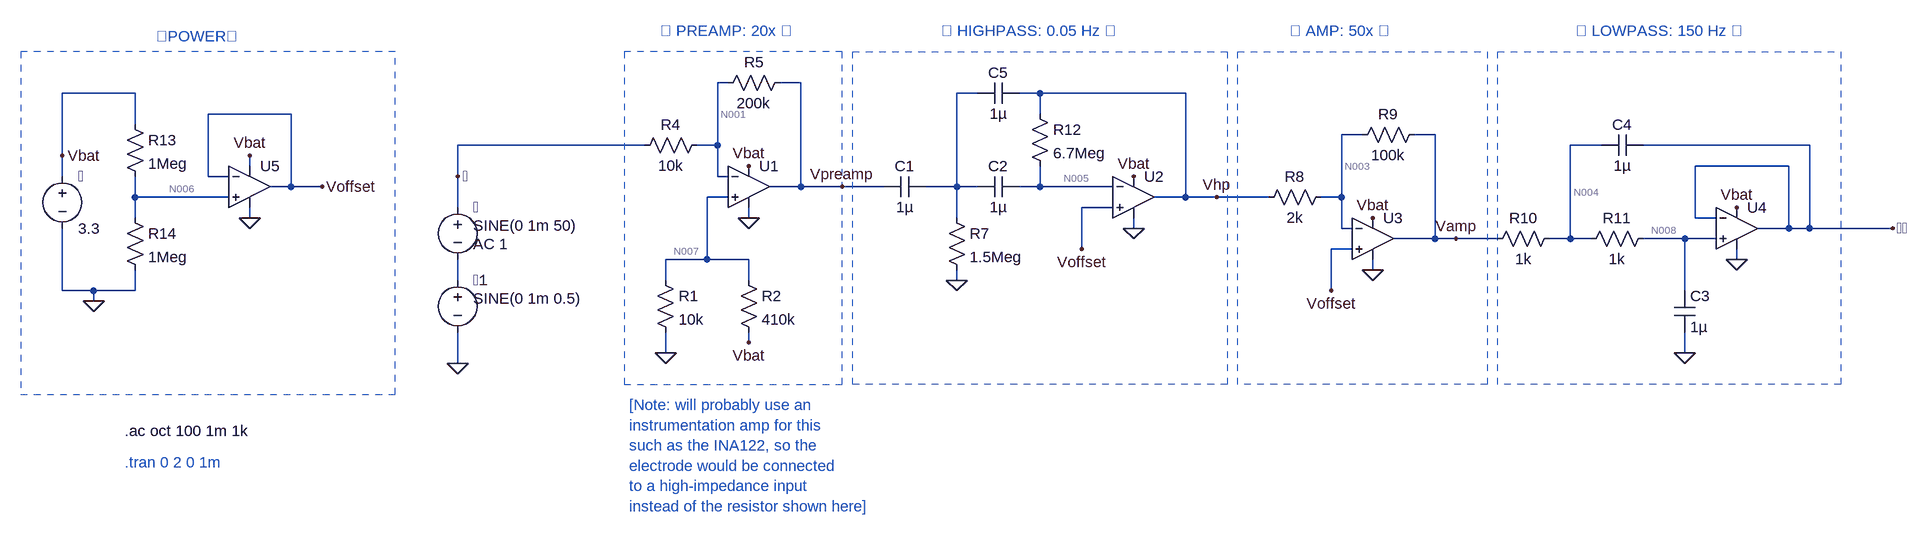
[diagram p0: schematic ecg_amp_filter.asc]
ecg_amp_filter.asc, the LTspice schematic file:
Version 4
SHEET 1 2764 680
WIRE 752 -1728 736 -1728
WIRE 864 -1728 832 -1728
WIRE -160 -1712 -272 -1712
WIRE 1136 -1712 1104 -1712
WIRE 1232 -1712 1200 -1712
WIRE 1456 -1712 1232 -1712
WIRE 80 -1680 -48 -1680
WIRE 1232 -1680 1232 -1712
WIRE -160 -1664 -160 -1712
WIRE 1728 -1648 1696 -1648
WIRE 1840 -1648 1808 -1648
WIRE 624 -1632 336 -1632
WIRE 736 -1632 736 -1728
WIRE 736 -1632 704 -1632
WIRE 2096 -1632 2048 -1632
WIRE 2416 -1632 2160 -1632
WIRE -272 -1616 -272 -1712
WIRE 16 -1600 16 -1616
WIRE 2384 -1600 2240 -1600
WIRE -272 -1584 -272 -1616
WIRE -48 -1584 -48 -1680
WIRE -16 -1584 -48 -1584
WIRE 336 -1584 336 -1632
WIRE 736 -1584 736 -1632
WIRE 752 -1584 736 -1584
WIRE 80 -1568 80 -1680
WIRE 80 -1568 48 -1568
WIRE 128 -1568 80 -1568
WIRE 864 -1568 864 -1728
WIRE 864 -1568 816 -1568
WIRE 928 -1568 864 -1568
WIRE 992 -1568 928 -1568
WIRE 1104 -1568 1104 -1712
WIRE 1104 -1568 1056 -1568
WIRE 1136 -1568 1104 -1568
WIRE 1232 -1568 1232 -1600
WIRE 1232 -1568 1200 -1568
WIRE 1344 -1568 1232 -1568
WIRE -160 -1552 -160 -1584
WIRE -16 -1552 -160 -1552
WIRE 752 -1552 720 -1552
WIRE 1456 -1552 1456 -1712
WIRE 1456 -1552 1408 -1552
WIRE 1504 -1552 1456 -1552
WIRE 1584 -1552 1504 -1552
WIRE 1696 -1552 1696 -1648
WIRE 1696 -1552 1664 -1552
WIRE 336 -1536 336 -1584
WIRE 1344 -1536 1296 -1536
WIRE -160 -1520 -160 -1552
WIRE 16 -1520 16 -1536
WIRE 784 -1520 784 -1536
WIRE 1104 -1520 1104 -1568
WIRE 2240 -1520 2240 -1600
WIRE 2272 -1520 2240 -1520
WIRE 1376 -1504 1376 -1520
WIRE 1696 -1504 1696 -1552
WIRE 1712 -1504 1696 -1504
WIRE 2384 -1504 2384 -1600
WIRE 2384 -1504 2336 -1504
WIRE 2416 -1504 2416 -1632
WIRE 2416 -1504 2384 -1504
WIRE 2544 -1504 2416 -1504
WIRE 1840 -1488 1840 -1648
WIRE 1840 -1488 1776 -1488
WIRE 1872 -1488 1840 -1488
WIRE 1936 -1488 1872 -1488
WIRE 2048 -1488 2048 -1632
WIRE 2048 -1488 2016 -1488
WIRE 2080 -1488 2048 -1488
WIRE 2224 -1488 2160 -1488
WIRE 2272 -1488 2224 -1488
WIRE 1296 -1472 1296 -1536
WIRE 1712 -1472 1680 -1472
WIRE 720 -1456 720 -1552
WIRE 720 -1456 656 -1456
WIRE 784 -1456 720 -1456
WIRE 2304 -1456 2304 -1472
WIRE 1744 -1440 1744 -1456
WIRE 336 -1424 336 -1456
WIRE 656 -1424 656 -1456
WIRE 784 -1424 784 -1456
WIRE 1104 -1424 1104 -1440
WIRE -272 -1408 -272 -1504
WIRE -224 -1408 -272 -1408
WIRE -160 -1408 -160 -1440
WIRE -160 -1408 -224 -1408
WIRE 1680 -1408 1680 -1472
WIRE 2224 -1408 2224 -1488
WIRE -224 -1392 -224 -1408
WIRE 784 -1328 784 -1344
WIRE 656 -1312 656 -1344
WIRE 2224 -1312 2224 -1344
WIRE 336 -1296 336 -1344
FLAG 336 -1296 0
FLAG -272 -1616 Vbat
FLAG 784 -1600 Vbat
FLAG 1376 -1584 Vbat
FLAG 1744 -1520 Vbat
FLAG 2224 -1312 0
FLAG 2304 -1536 Vbat
FLAG 2544 -1504 🧡💻
FLAG 336 -1584 💛
FLAG 928 -1568 Vpreamp
FLAG 1872 -1488 Vamp
FLAG -224 -1392 0
FLAG 656 -1312 0
FLAG 784 -1328 Vbat
FLAG 784 -1520 0
FLAG 1376 -1504 0
FLAG 1744 -1440 0
FLAG 2304 -1456 0
FLAG 1104 -1424 0
FLAG 128 -1568 Voffset
FLAG 1296 -1472 Voffset
FLAG 1680 -1408 Voffset
FLAG 1504 -1552 Vhp
FLAG 16 -1616 Vbat
FLAG 16 -1520 0
SYMBOL voltage -272 -1600 R0
WINDOW 123 0 0 Left 0
WINDOW 39 0 0 Left 0
SYMATTR InstName 🔋
SYMATTR Value 3.3
SYMBOL voltage 336 -1552 R0
WINDOW 3 24 44 Left 2
WINDOW 123 24 72 Left 2
WINDOW 39 0 0 Left 0
SYMATTR Value SINE(0 1m 50)
SYMATTR Value2 AC 1
SYMATTR InstName 🤍
SYMBOL OpAmps\\UniversalOpAmp 784 -1568 R0
SYMATTR InstName U1
SYMBOL res 608 -1616 R270
WINDOW 0 32 56 VTop 2
WINDOW 3 0 56 VBottom 2
SYMATTR InstName R4
SYMATTR Value 10k
SYMBOL res 848 -1744 R90
WINDOW 0 0 56 VBottom 2
WINDOW 3 32 56 VTop 2
SYMATTR InstName R5
SYMATTR Value 200k
SYMBOL cap 992 -1552 R270
WINDOW 0 32 32 VTop 2
WINDOW 3 0 32 VBottom 2
SYMATTR InstName C1
SYMATTR Value 1µ
SYMBOL OpAmps\\UniversalOpAmp 1376 -1552 R0
SYMATTR InstName U2
SYMBOL OpAmps\\UniversalOpAmp 1744 -1488 R0
SYMATTR InstName U3
SYMBOL res 1680 -1568 R90
WINDOW 0 0 56 VBottom 2
WINDOW 3 32 56 VTop 2
SYMATTR InstName R8
SYMATTR Value 2k
SYMBOL res 1824 -1664 R90
WINDOW 0 0 56 VBottom 2
WINDOW 3 32 56 VTop 2
SYMATTR InstName R9
SYMATTR Value 100k
SYMBOL OpAmps\\UniversalOpAmp 2304 -1504 R0
SYMATTR InstName U4
SYMBOL res 2032 -1504 R90
WINDOW 0 0 56 VBottom 2
WINDOW 3 32 56 VTop 2
SYMATTR InstName R10
SYMATTR Value 1k
SYMBOL res 2176 -1504 R90
WINDOW 0 0 56 VBottom 2
WINDOW 3 32 56 VTop 2
SYMATTR InstName R11
SYMATTR Value 1k
SYMBOL cap 2208 -1408 R0
SYMATTR InstName C3
SYMATTR Value 1µ
SYMBOL cap 2160 -1648 R90
WINDOW 0 0 32 VBottom 2
WINDOW 3 32 32 VTop 2
SYMATTR InstName C4
SYMATTR Value 1µ
SYMBOL voltage 336 -1440 R0
WINDOW 3 24 44 Left 2
WINDOW 123 24 72 Left 2
WINDOW 39 0 0 Left 0
SYMATTR Value SINE(0 1m 0.5)
SYMATTR InstName 🤍1
SYMBOL res 640 -1440 R0
SYMATTR InstName R1
SYMATTR Value 10k
SYMBOL res 768 -1440 R0
SYMATTR InstName R2
SYMATTR Value 410k
SYMBOL res 1088 -1536 R0
SYMATTR InstName R7
SYMATTR Value 1.5Meg
SYMBOL res 1216 -1696 R0
SYMATTR InstName R12
SYMATTR Value 6.7Meg
SYMBOL cap 1200 -1584 R90
WINDOW 0 0 32 VBottom 2
WINDOW 3 32 32 VTop 2
SYMATTR InstName C2
SYMATTR Value 1µ
SYMBOL cap 1200 -1728 R90
WINDOW 0 0 32 VBottom 2
WINDOW 3 32 32 VTop 2
SYMATTR InstName C5
SYMATTR Value 1µ
SYMBOL res -176 -1680 R0
SYMATTR InstName R13
SYMATTR Value 1Meg
SYMBOL res -176 -1536 R0
SYMATTR InstName R14
SYMATTR Value 1Meg
SYMBOL OpAmps\\UniversalOpAmp 16 -1568 R0
SYMATTR InstName U5
TEXT -176 -1192 Left 2 !.ac oct 100 1m 1k
TEXT -128 -1800 Left 2 ;⚡POWER⚡
TEXT 648 -1808 Left 2 ;⏫ PREAMP: 20x ⏫
TEXT 1080 -1808 Left 2 ;⏩ HIGHPASS: 0.05 Hz ⏩
TEXT 2056 -1808 Left 2 ;⏪ LOWPASS: 150 Hz ⏪
TEXT 1616 -1808 Left 2 ;⏫ AMP: 50x ⏫
TEXT -176 -1144 Left 2 ;.tran 0 2 0 1m
TEXT 600 -1232 Left 2 ;[Note: will probably use an \ninstrumentation amp for this \nsuch as the INA122, so the \nelectrode would be connected \nto a high-impedance input \ninstead of the resistor shown here]
RECTANGLE Normal 1520 -1264 944 -1776 2
RECTANGLE Normal 1920 -1264 1536 -1776 2
RECTANGLE Normal 2464 -1264 1936 -1776 2
RECTANGLE Normal 592 -1264 928 -1776 2
RECTANGLE Normal -336 -1248 240 -1776 2

The netlist it stands for:
* ecg_amp_filter.asc
V§🔋 Vbat 0 3.3
V§🤍 💛 N009 SINE(0 1m 50) AC 1
XU1 N007 N001 Vbat 0 Vpreamp level1 Avol=1Meg GBW=10Meg Vos=0 En=0 Enk=0 In=0 Ink=0 Rin=500Meg  ; pins In+ In- V+ V- OUT
R4 💛 N001 10k
R5 Vpreamp N001 200k
C1 Vpreamp N002 1µ
XU2 Voffset N005 Vbat 0 Vhp level1 Avol=1Meg GBW=10Meg Vos=0 En=0 Enk=0 In=0 Ink=0 Rin=500Meg  ; pins In+ In- V+ V- OUT
XU3 Voffset N003 Vbat 0 Vamp level1 Avol=1Meg GBW=10Meg Vos=0 En=0 Enk=0 In=0 Ink=0 Rin=500Meg  ; pins In+ In- V+ V- OUT
R8 N003 Vhp 2k
R9 Vamp N003 100k
XU4 N008 🧡💻 Vbat 0 🧡💻 level1 Avol=1Meg GBW=10Meg Vos=0 En=0 Enk=0 In=0 Ink=0 Rin=500Meg  ; pins In+ In- V+ V- OUT
R10 N004 Vamp 1k
R11 N008 N004 1k
C3 N008 0 1µ
C4 🧡💻 N004 1µ
V§🤍1 N009 0 SINE(0 1m 0.5)
R1 N007 0 10k
R2 N007 Vbat 410k
R7 N002 0 1.5Meg
R12 Vhp N005 6.7Meg
C2 N005 N002 1µ
C5 Vhp N002 1µ
R13 Vbat N006 1Meg
R14 N006 0 1Meg
XU5 N006 Voffset Vbat 0 Voffset level1 Avol=1Meg GBW=10Meg Vos=0 En=0 Enk=0 In=0 Ink=0 Rin=500Meg  ; pins In+ In- V+ V- OUT
.ac oct 100 1m 1k
* ⚡POWER⚡
* ⏫ PREAMP: 20x ⏫
* ⏩ HIGHPASS: 0.05 Hz ⏩
* ⏪ LOWPASS: 150 Hz ⏪
* ⏫ AMP: 50x ⏫
* .tran 0 2 0 1m
* [Note: will probably use an
* instrumentation amp for this
* such as the INA122, so the
* electrode would be connected
* to a high-impedance input
* instead of the resistor shown here]
.lib UniversalOpAmp1.lib
.backanno
.end

* Results of the author's LTspice run, read from the files saved beside the schematic
* Operating Point, zero values left out:
*   V(vbat) = 3.3 V
*   V(n001) = 78.6 mV
*   V(n007) = 78.6 mV
*   V(vpreamp) = 1.65 V
*   V(n005) = 1.65 V
*   V(voffset) = 1.65 V
*   V(vhp) = 1.65 V
*   V(n003) = 1.65 V
*   V(vamp) = 1.65 V
*   V(🧡💻) = 1.65 V
*   V(n008) = 1.65 V
*   V(n004) = 1.65 V
*   V(n006) = 1.65 V
*   I(R14) = 1.65 µA
*   I(R13) = 1.65 µA
*   I(R2) = -7.857 µA
*   I(R1) = 7.86 µA
*   I(R9) = 22 pA
*   I(R8) = 22 pA
*   I(R5) = 7.857 µA
*   I(R4) = -7.86 µA
*   I(🤍1) = 7.86 µA
*   I(🤍) = 7.86 µA
*   I(🔋) = -9.527 µA
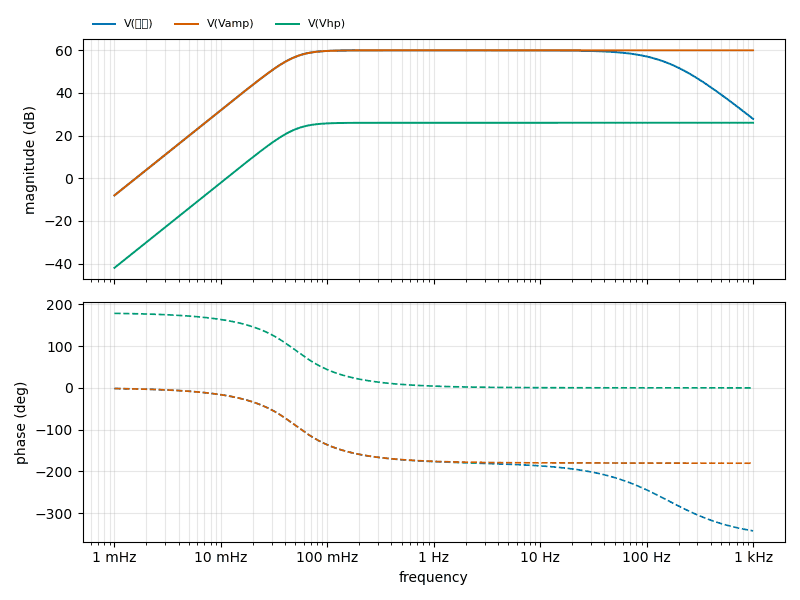
[diagram p1: AC Analysis of ecg_amp_filter.asc, plotted from the saved traces]
* AC Analysis, 1 run:
*   V(🧡💻): -8.03 dB at 1 mHz, 27.85 dB at 1 kHz, peak 60.00 dB at 903.9 mHz, 3 dB below the peak at 50.39 mHz and 102.4 Hz
*   V(Vamp): -8.03 dB at 1 mHz, 60.00 dB at 1 kHz, peak 60.00 dB at 33.23 Hz, 3 dB below the peak at 50.39 mHz
*   V(Vhp): -42.01 dB at 1 mHz, 26.02 dB at 1 kHz, peak 26.02 dB at 53.97 Hz, 3 dB below the peak at 50.39 mHz